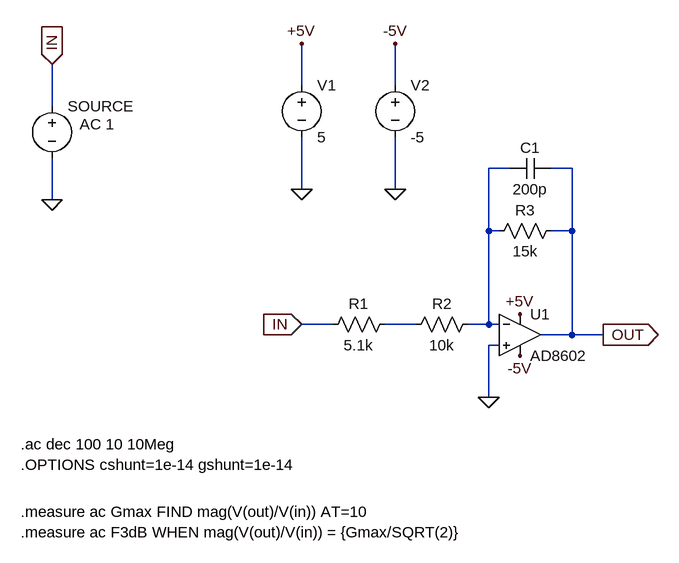
[diagram p0: schematic g_min1_bw_max.asc]
g_min1_bw_max.asc, the LTspice schematic file:
Version 4.1
SHEET 1 880 680
WIRE 96 -128 96 -192
WIRE 240 -128 240 -192
WIRE -288 -96 -288 -160
WIRE 416 0 384 0
WIRE 512 0 480 0
WIRE 96 32 96 -48
WIRE 240 32 240 -48
WIRE -288 48 -288 -16
WIRE 384 96 384 0
WIRE 400 96 384 96
WIRE 512 96 512 0
WIRE 512 96 480 96
WIRE 144 240 96 240
WIRE 272 240 224 240
WIRE 384 240 384 96
WIRE 384 240 352 240
WIRE 400 240 384 240
WIRE 512 256 512 96
WIRE 512 256 464 256
WIRE 560 256 512 256
WIRE 400 272 384 272
WIRE 384 352 384 272
FLAG 96 -192 +5V
FLAG 240 -192 -5V
FLAG 96 32 0
FLAG 240 32 0
FLAG 96 240 IN
IOPIN 96 240 In
FLAG 384 352 0
FLAG 432 288 -5V
FLAG 432 224 +5V
FLAG 560 256 OUT
IOPIN 560 256 Out
FLAG -288 -160 IN
IOPIN -288 -160 In
FLAG -288 48 0
SYMBOL OpAmps\\AD8602 432 192 R0
SYMATTR InstName U1
SYMBOL voltage 96 -144 R0
WINDOW 123 0 0 Left 0
WINDOW 39 0 0 Left 0
SYMATTR InstName V1
SYMATTR Value 5
SYMBOL voltage 240 -144 R0
WINDOW 123 0 0 Left 0
WINDOW 39 0 0 Left 0
SYMATTR InstName V2
SYMATTR Value -5
SYMBOL res 240 224 R90
WINDOW 0 0 56 VBottom 2
WINDOW 3 32 56 VTop 2
SYMATTR InstName R1
SYMATTR Value 5.1k
SYMBOL res 368 224 R90
WINDOW 0 0 56 VBottom 2
WINDOW 3 32 56 VTop 2
SYMATTR InstName R2
SYMATTR Value 10k
SYMBOL res 496 80 R90
WINDOW 0 0 56 VBottom 2
WINDOW 3 32 56 VTop 2
SYMATTR InstName R3
SYMATTR Value 15k
SYMBOL cap 480 -16 R90
WINDOW 0 0 32 VBottom 2
WINDOW 3 32 32 VTop 2
SYMATTR InstName C1
SYMATTR Value 200p
SYMATTR SpiceLine V=250
SYMBOL voltage -288 -112 R0
WINDOW 123 43 44 Left 2
WINDOW 39 0 0 Left 0
SYMATTR Value2 AC 1
SYMATTR InstName SOURCE
SYMATTR Value ""
TEXT -336 424 Left 2 !.ac dec 100 10 10Meg
TEXT -336 456 Left 2 !.OPTIONS cshunt=1e-14 gshunt=1e-14
TEXT -336 528 Left 2 !.measure ac Gmax FIND mag(V(out)/V(in)) AT=10
TEXT -336 560 Left 2 !.measure ac F3dB WHEN mag(V(out)/V(in)) = {Gmax/SQRT(2)}

The netlist it stands for:
* g_min1_bw_max.asc
X§U1 0 N001 +5V -5V OUT AD8602  ; pins In+ In- V+ V- OUT
V1 +5V 0 5
V2 -5V 0 -5
R1 N002 IN 5.1k
R2 N001 N002 10k
R3 OUT N001 15k
C1 OUT N001 200p V=250
V§SOURCE IN 0 AC 1
.ac dec 100 10 10Meg
.OPTIONS cshunt=1e-14 gshunt=1e-14
.measure ac Gmax FIND mag(V(out)/V(in)) AT=10
.measure ac F3dB WHEN mag(V(out)/V(in)) = {Gmax/SQRT(2)}
.backanno
.end